# Altium schematic sheet SYS-PS.SchDoc
size A3
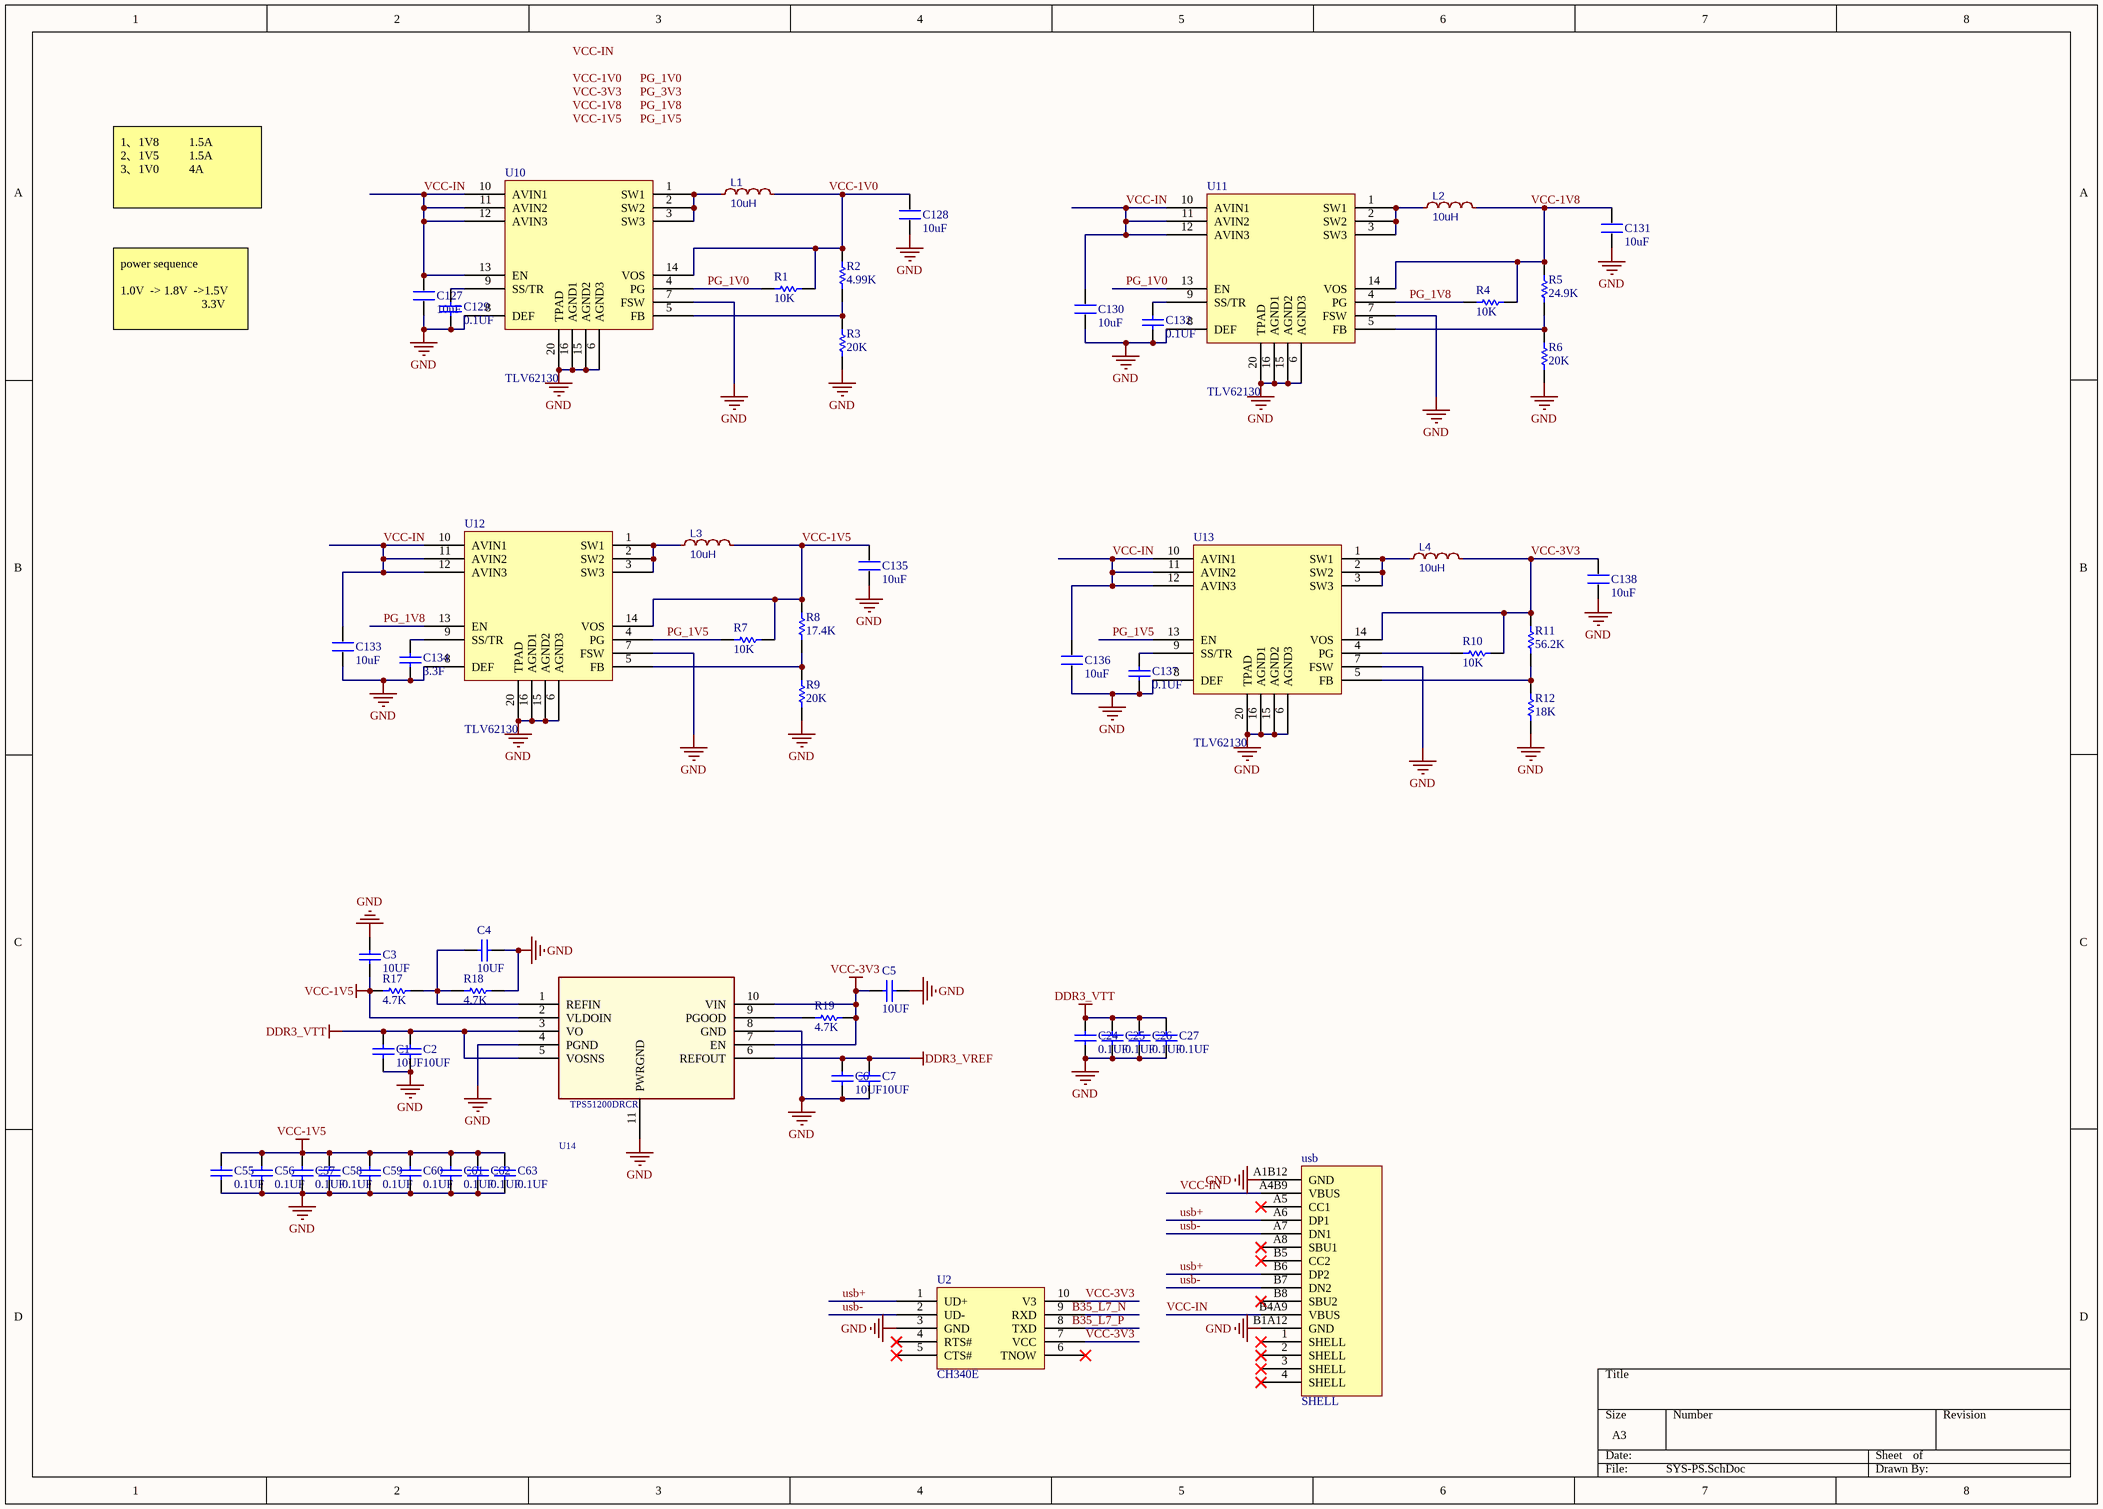
[diagram p0: SYS-PS.SchDoc]

## Parts
C1  10UF  [0402]
C2  10UF  [0402]
C3  10UF  [0402]
C4  10UF  [0402]
C5  10UF  [0402]
C6  10UF  [0402]
C7  10UF  [0402]
C24  0.1UF  [0402]
C25  0.1UF  [0402]
C26  0.1UF  [0402]
C27  0.1UF  [0402]
C55  0.1UF  [0402]
C56  0.1UF  [0402]
C57  0.1UF  [0402]
C58  0.1UF  [0402]
C59  0.1UF  [0402]
C60  0.1UF  [0402]
C61  0.1UF  [0402]
C62  0.1UF  [0402]
C63  0.1UF  [0402]
C127  10uF  [C0805]
C128  10uF  [C0805]
C129  0.1UF  [0402]
C130  10uF  [C0805]
C131  10uF  [C0805]
C132  0.1UF  [0402]
C133  10uF  [C0805]
C134  3.3F  [0402]
C135  10uF  [C0805]
C136  10uF  [C0805]
C137  0.1UF  [0402]
C138  10uF  [C0805]
L1  10uH  [L1008]
L2  10uH  [L1008]
L3  10uH  [L1008]
L4  10uH  [L1008]
R1  10K  [0402]
R2  4.99K  [0402]
R3  20K  [0402]
R4  10K  [0402]
R5  value 24.9K  [0402]  (hidden comment: 4.99K)
R6  value 20K  [0402]  (hidden comment: 15K)
R7  10K  [0402]
R8  value 17.4K  [0402]  (hidden comment: 4.99K)
R9  value 20K  [0402]  (hidden comment: 15K)
R10  10K  [0402]
R11  value 56.2K  [0402]  (hidden comment: 4.99K)
R12  value 18K  [0402]  (hidden comment: 15K)
R17  value 4.7K  [0402]  (hidden comment: 1K)
R18  value 4.7K  [0402]  (hidden comment: 1K)
R19  value 4.7K  [0402]  (hidden comment: 1K)
U2  CH340E  [CH340E]
U10  TLV62130  [TLV62130RGT]
U11  TLV62130  [TLV62130RGT]
U12  TLV62130  [TLV62130RGT]
U13  TLV62130  [TLV62130RGT]
U14  TPS51200DRCR  [TPS_QFN10]
usb  SHELL  [USB-C-SMD_TYPE-C16PIN_C668624]

## Nets
DDR3_VREF: C6.2 C7.2 U14.6(REFOUT)
DDR3_VTT: C1.2 C2.2 C24.2 C25.2 C26.2 C27.2 U14.3(VO) U14.5(VOSNS)
GND: C1.1 C2.1 C3.1 C4.2 C5.2 C6.1 C7.1 C24.1 C25.1 C26.1 C27.1 C55.1 C56.1 C57.1 C58.1 C59.1 C60.1 C61.1 C62.1 C63.1 C127.1 C128.1 C129.1 C130.1 C131.1 C132.1 C133.1 C134.1 C135.1 C136.1 C137.1 C138.1 R3.1 R6.1 R9.1 R12.1 R18.2 U2.3(GND) U10.6(AGND3) U10.7(FSW) U10.8(DEF) U10.15(AGND2) U10.16(AGND1) U10.20(TPAD) U11.6(AGND3) U11.7(FSW) U11.8(DEF) U11.15(AGND2) U11.16(AGND1) U11.20(TPAD) U12.6(AGND3) U12.7(FSW) U12.8(DEF) U12.15(AGND2) U12.16(AGND1) U12.20(TPAD) U13.6(AGND3) U13.7(FSW) U13.8(DEF) U13.15(AGND2) U13.16(AGND1) U13.20(TPAD) U14.4(PGND) U14.8(GND) U14.11(PWRGND) usb.A1B12(GND) usb.B1A12(GND)
VCC-1V5: C3.2 C55.2 C56.2 C57.2 C58.2 C59.2 C60.2 C61.2 C62.2 C63.2 C135.2 L3.2 R7.2 R8.2 R17.1 U12.14(VOS) U14.2(VLDOIN)
VCC-3V3: C5.1 C138.2 L4.2 R10.2 R11.2 R19.2 U2.7(VCC) U2.10(V3) U13.14(VOS) U14.7(EN) U14.10(VIN)
PG_1V0: R1.1 U10.4(PG) U11.13(EN)
PG_1V5: R7.1 U12.4(PG) U13.13(EN)
PG_1V8: R4.1 U11.4(PG) U12.13(EN)
usb+: U2.1(UD+) usb.A6(DP1) usb.B6(DP2)
usb-: U2.2(UD-) usb.A7(DN1) usb.B7(DN2)
VCC-1V0: C128.2 L1.2 R1.2 R2.2 U10.14(VOS)
VCC-1V8: C131.2 L2.2 R4.2 R5.2 U11.14(VOS)
VCC-IN: C127.2 C130.2 C133.2 C136.2 U10.10(AVIN1) U10.11(AVIN2) U10.12(AVIN3) U10.13(EN) U11.10(AVIN1) U11.11(AVIN2) U11.12(AVIN3) U12.10(AVIN1) U12.11(AVIN2) U12.12(AVIN3) U13.10(AVIN1) U13.11(AVIN2) U13.12(AVIN3) usb.A4B9(VBUS) usb.B4A9(VBUS)
NetC4_1: C4.1 R17.2 R18.1 U14.1(REFIN)
NetC129_2: C129.2 U10.9(SS/TR)
NetC132_2: C132.2 U11.9(SS/TR)
NetC134_2: C134.2 U12.9(SS/TR)
NetC137_2: C137.2 U13.9(SS/TR)
NetL1_1: L1.1 U10.1(SW1) U10.2(SW2) U10.3(SW3)
NetL2_1: L2.1 U11.1(SW1) U11.2(SW2) U11.3(SW3)
NetL3_1: L3.1 U12.1(SW1) U12.2(SW2) U12.3(SW3)
NetL4_1: L4.1 U13.1(SW1) U13.2(SW2) U13.3(SW3)
NetR2_1: R2.1 R3.2 U10.5(FB)
NetR5_1: R5.1 R6.2 U11.5(FB)
NetR8_1: R8.1 R9.2 U12.5(FB)
NetR10_1: R10.1 U13.4(PG)
NetR11_1: R11.1 R12.2 U13.5(FB)
NetR19_1: R19.1 U14.9(PGOOD)

Not connected (* = marked no-connect by the designer): U2 4(RTS#)* 5(CTS#)* 6(TNOW)* 8(TXD) 9(RXD); usb 1(SHELL)* 2(SHELL)* 3(SHELL)* 4(SHELL)* A5(CC1)* A8(SBU1)* B5(CC2)* B8(SBU2)*

## Notes on the sheet
- 1、1V8          1.5A
  2、1V5          1.5A
  3、1V0          4A
- power sequence
  1.0V  -> 1.8V  ->1.5V
  3.3V
- Labels drawn without touching a wire or pin: B35_L7_N, B35_L7_P, PG_1V0, PG_1V5, PG_1V8, PG_3V3, VCC-1V0, VCC-1V5, VCC-1V8, VCC-3V3, VCC-IN

## Library data of the parts
C1-C7 C24-C27 C55-C63 = Cap: Capacitor; Published: 8-Jun-2000; LatestRevisionDate: 17-Jul-2002; LatestRevisionNote: Re-released for DXP Platform.; PackageReference: RAD-0.3; Publisher: Altium Limited; PackageDescription: Radial Cap, Thru-Hole; 2 Leads; 0.3 in Pin Spacing
  C1-C7: Value: 10UF
  C24-C27 C55-C63: Value: 0.1UF
C127 C128 C130 C131 C133 C135 C136 C138 = C
C129 C132 C134 C137 = Cap: Capacitor; Value: 3.3nF; Published: 8-Jun-2000; LatestRevisionDate: 17-Jul-2002; LatestRevisionNote: Re-released for DXP Platform.; PackageReference: RAD-0.3; Publisher: Altium Limited; PackageDescription: Radial Cap, Thru-Hole; 2 Leads; 0.3 in Pin Spacing
L1-L4 = 10uH: BOM_Manufacturer: Sunlord; BOM_Manufacturer Part: MPL2520S100MWT; nameAlias: Inductance; Contributor: LCSC; BOM_Supplier: LCSC; BOM_Supplier Part: C370039; spicePre: L; spiceSymbolName: MPL2520S100MWT
R1-R12 R17-R19 = Res1: Resistor; Published: 8-Jun-2000; LatestRevisionDate: 17-Jul-2002; LatestRevisionNote: Re-released for DXP Platform.; PackageReference: AXIAL-0.3; Publisher: Altium Limited; PackageDescription: Axial Device, Thru-Hole; 2 Leads; 0.3 in Pin Spacing
  R1 R4 R7 R10: Value: 10K
  R2: Value: 4.99K
  R3: Value: 20K
usb = typec_16p